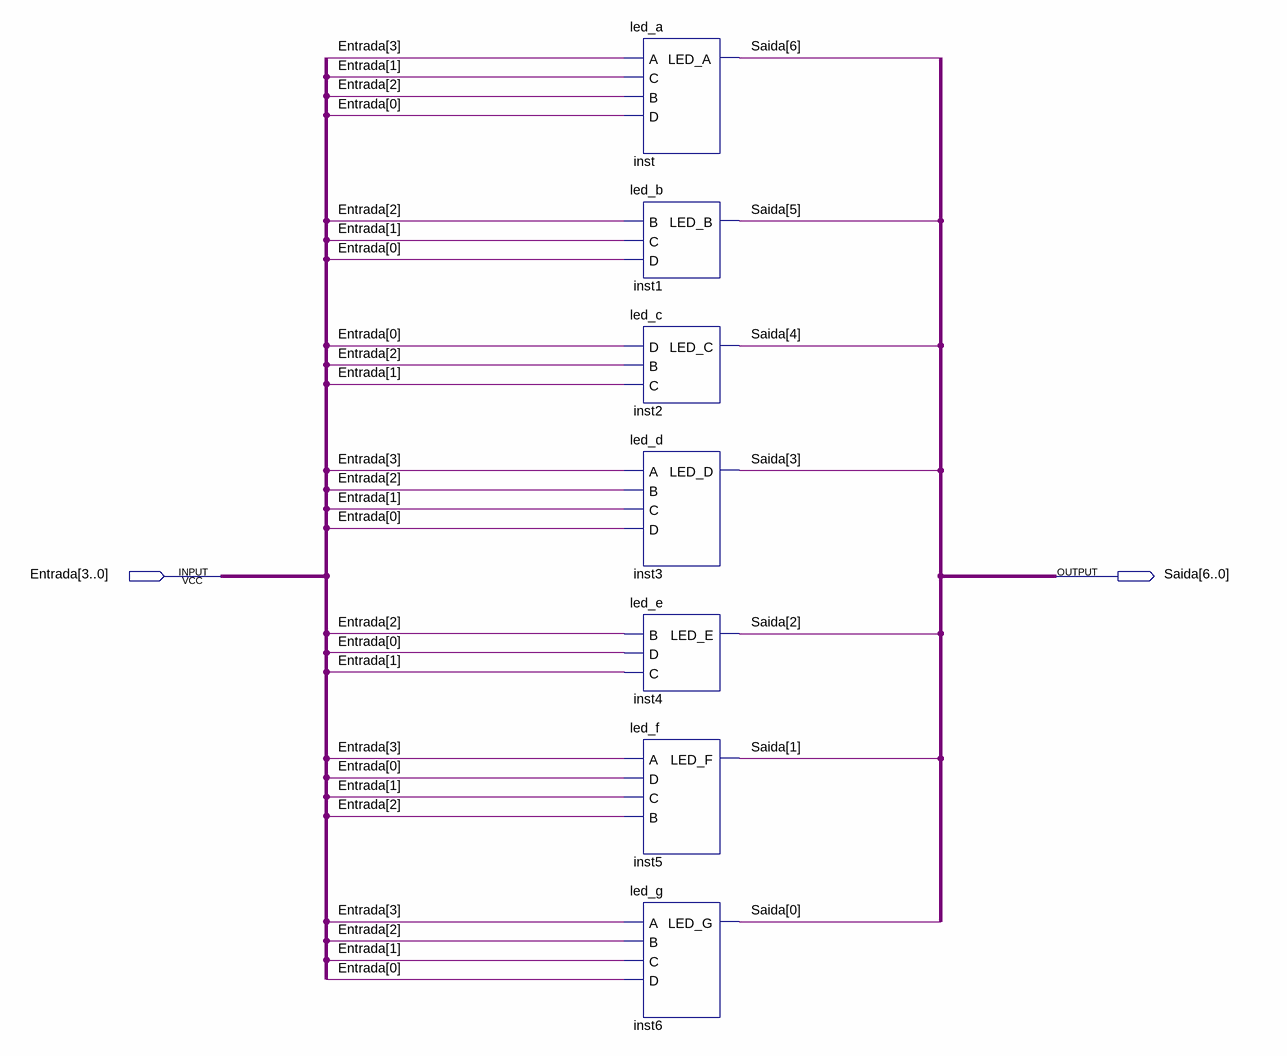
[diagram p0: schematic sheet]
// Quartus schematic display_bcd.bdf as structural Verilog: 7 symbols, 2 pins
module display_bcd (
  input  [3:0] Entrada,
  output [6:0] Saida
);

  led_a inst (.A(Entrada[3]), .C(Entrada[1]), .B(Entrada[2]), .D(Entrada[0]), .LED_A(Saida[6]));
  led_b inst1 (.B(Entrada[2]), .C(Entrada[1]), .D(Entrada[0]), .LED_B(Saida[5]));
  led_c inst2 (.D(Entrada[0]), .B(Entrada[2]), .C(Entrada[1]), .LED_C(Saida[4]));
  led_d inst3 (.A(Entrada[3]), .B(Entrada[2]), .C(Entrada[1]), .D(Entrada[0]), .LED_D(Saida[3]));
  led_e inst4 (.B(Entrada[2]), .D(Entrada[0]), .C(Entrada[1]), .LED_E(Saida[2]));
  led_f inst5 (.A(Entrada[3]), .D(Entrada[0]), .C(Entrada[1]), .B(Entrada[2]), .LED_F(Saida[1]));
  led_g inst6 (.A(Entrada[3]), .B(Entrada[2]), .C(Entrada[1]), .D(Entrada[0]), .LED_G(Saida[0]));
endmodule
